# Altium schematic sheet RegisterA.schdoc
size 208 x 180 mm
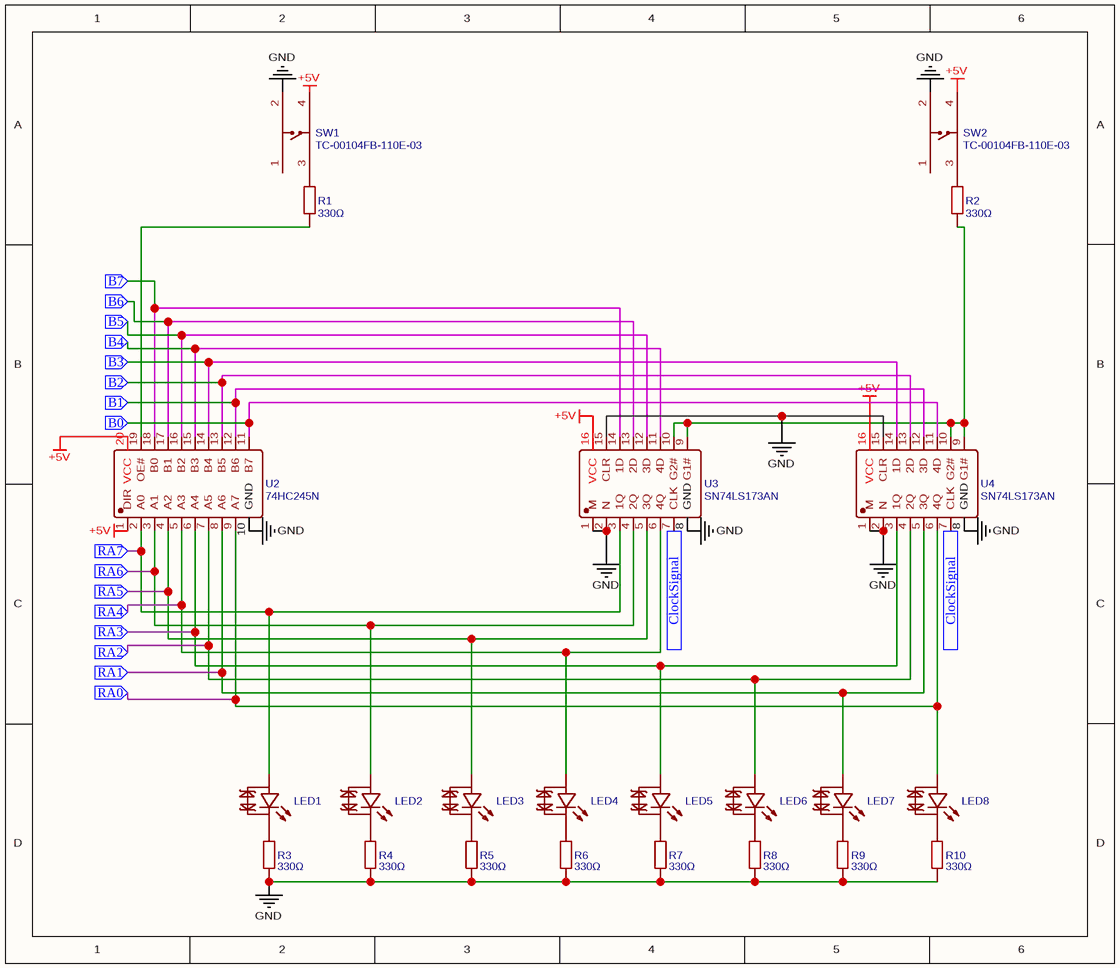
[diagram p0: RegisterA.schdoc]

## Parts
LED1  204-15UTC/S400-X9-L  [LED-TH_BD3.0-P2.54-FD]  (value not drawn)
LED2  204-15UTC/S400-X9-L  [LED-TH_BD3.0-P2.54-FD]  (value not drawn)
LED3  204-15UTC/S400-X9-L  [LED-TH_BD3.0-P2.54-FD]  (value not drawn)
LED4  204-15UTC/S400-X9-L  [LED-TH_BD3.0-P2.54-FD]  (value not drawn)
LED5  204-15UTC/S400-X9-L  [LED-TH_BD3.0-P2.54-FD]  (value not drawn)
LED6  204-15UTC/S400-X9-L  [LED-TH_BD3.0-P2.54-FD]  (value not drawn)
LED7  204-15UTC/S400-X9-L  [LED-TH_BD3.0-P2.54-FD]  (value not drawn)
LED8  204-15UTC/S400-X9-L  [LED-TH_BD3.0-P2.54-FD]  (value not drawn)
R1  330Ω  [RES-TH_BD3.3-L9.0-P13.00-D0.6]
R2  330Ω  [RES-TH_BD3.3-L9.0-P13.00-D0.6]
R3  330Ω  [RES-TH_BD3.3-L9.0-P13.00-D0.6]
R4  330Ω  [RES-TH_BD3.3-L9.0-P13.00-D0.6]
R5  330Ω  [RES-TH_BD3.3-L9.0-P13.00-D0.6]
R6  330Ω  [RES-TH_BD3.3-L9.0-P13.00-D0.6]
R7  330Ω  [RES-TH_BD3.3-L9.0-P13.00-D0.6]
R8  330Ω  [RES-TH_BD3.3-L9.0-P13.00-D0.6]
R9  330Ω  [RES-TH_BD3.3-L9.0-P13.00-D0.6]
R10  330Ω  [RES-TH_BD3.3-L9.0-P13.00-D0.6]
SW1  TC-00104FB-110E-03  [SW-TH_4P-L6.0-W6.0-P4.50-LS6.5]
SW2  TC-00104FB-110E-03  [SW-TH_4P-L6.0-W6.0-P4.50-LS6.5]
U2  74HC245N  [DIP-20_L26.8-W6.4-P2.54-LS7.6-BL]
U3  SN74LS173AN  [PDIP-16_L19.3-W6.4-P2.54-LS7.94-BL]
U4  SN74LS173AN  [PDIP-16_L19.3-W6.4-P2.54-LS7.94-BL]

## Ports
B0 (in), B1 (in), B2 (in), B3 (in), B4 (in), B5 (in), B6 (in), B7 (in), ClockSignal (in), RA0 (in), RA1 (in), RA2 (in), RA3 (in), RA4 (in), RA5 (in), RA6 (in), RA7 (in)

## Nets
+5V: SW2.4 U2.1(DIR) U2.20(VCC) U3.16(VCC) U4.16(VCC)
GND: R3.2 R4.2 R5.2 R6.2 R7.2 R8.2 R9.2 R10.2 SW1.2 SW2.2 U2.10(GND) U3.1(M) U3.2(N) U3.8(GND) U3.15(CLR) U4.1(M) U4.2(N) U4.8(GND) U4.15(CLR)
B0: U2.11(B7) U4.11(4D) ; port B0
B1: U2.12(B6) U4.12(3D) ; port B1
B2: U2.13(B5) U4.13(2D) ; port B2
B3: U2.14(B4) U4.14(1D) ; port B3
B4: U2.15(B3) U3.11(4D) ; port B4
B5: U2.16(B2) U3.12(3D) ; port B5
B6: U2.17(B1) U3.13(2D) ; port B6
B7: U2.18(B0) U3.14(1D) ; port B7
ClockSignal: U3.7(CLK) U4.7(CLK) ; port ClockSignal
RA0: LED8.1(A) U2.9(A7) U4.6(4Q) ; port RA0
RA1: LED7.1(A) U2.8(A6) U4.5(3Q) ; port RA1
RA2: LED6.1(A) U2.7(A5) U4.4(2Q) ; port RA2
RA3: LED5.1(A) U2.6(A4) U4.3(1Q) ; port RA3
RA4: LED4.1(A) U2.5(A3) U3.6(4Q) ; port RA4
RA5: LED3.1(A) U2.4(A2) U3.5(3Q) ; port RA5
RA6: LED2.1(A) U2.3(A1) U3.4(2Q) ; port RA6
RA7: LED1.1(A) U2.2(A0) U3.3(1Q) ; port RA7
NetLED1_2: LED1.2(C) R3.1
NetLED2_2: LED2.2(C) R4.1
NetLED3_2: LED3.2(C) R5.1
NetLED4_2: LED4.2(C) R6.1
NetLED5_2: LED5.2(C) R7.1
NetLED6_2: LED6.2(C) R8.1
NetLED7_2: LED7.2(C) R9.1
NetLED8_2: LED8.2(C) R10.1
NetR1_1: R1.1 U2.19(OE#)
NetR1_2: R1.2 SW1.3
NetR2_1: R2.1 U3.9(G1#) U3.10(G2#) U4.9(G1#) U4.10(G2#)
NetR2_2: R2.2 SW2.3

Not connected (* = marked no-connect by the designer): SW1 1 4; SW2 1

## Notes on the sheet
- Labels drawn without touching a wire or pin: +5V

## Library data of the parts
LED1-LED8 = 204-15UTC/S400-X9-L: Manufacturer: EVERLIGHT(亿光); Contributor: LCSC; Supplier: LCSC; Supplier Part: C282138; Manufacturer Part: 204-15UTC/S400-X9-L; JLCPCB Part Class: Extended Part; spicePre: L; spiceSymbolName: 204-15UTC/S400-X9-L
R1-R10 = 330Ω: Manufacturer: CCO(千志电子); Manufacturer Part: MF1/2W-0.1Ω±1% T; nameAlias: Value; Contributor: LCSC; Supplier: LCSC; Supplier Part: C119393; JLCPCB Part Class: Extended Part; spicePre: R; spiceSymbolName: MF1/2W-0.1Ω±1% T52
SW1 SW2 = TC-00104FB-110E-03: Manufacturer: HOOYA(皓宇电子); Contributor: lcsc; Supplier: LCSC; Supplier Part: C7542981; Manufacturer Part: TC-00104FB-110E-03; JLCPCB Part Class: Extended Part; spicePre: S; spiceSymbolName: TC-00104FB-110E-03
U2 = 74HC245N: Manufacturer: HGSEMI(华冠); Contributor: LCSC; Supplier: LCSC; Supplier Part: C507182; Manufacturer Part: 74HC245N; JLCPCB Part Class: Extended Part; spicePre: U; spiceSymbolName: 74HC245N
U3 U4 = SN74LS173AN: Manufacturer: TI(德州仪器); Contributor: LCSC; Supplier: LCSC; Supplier Part: C1550125; Manufacturer Part: SN74LS173AN; JLCPCB Part Class: Extended Part; spicePre: U; spiceSymbolName: SN74LS173AN